# EasyEDA Pro project ProPrj_LPM012M134B_testboard_2025-07-12.epro

# Schematic Schematic1
Board Name: Board1; Create Date: 2025-06-02; Page Name: P1; Project Name: LPM012M134B_testboard; Schematic Name: Schematic1; Update Date: 2025-07-09; Company: 嘉立创EDA; Page Size: A4; Version: V1.0
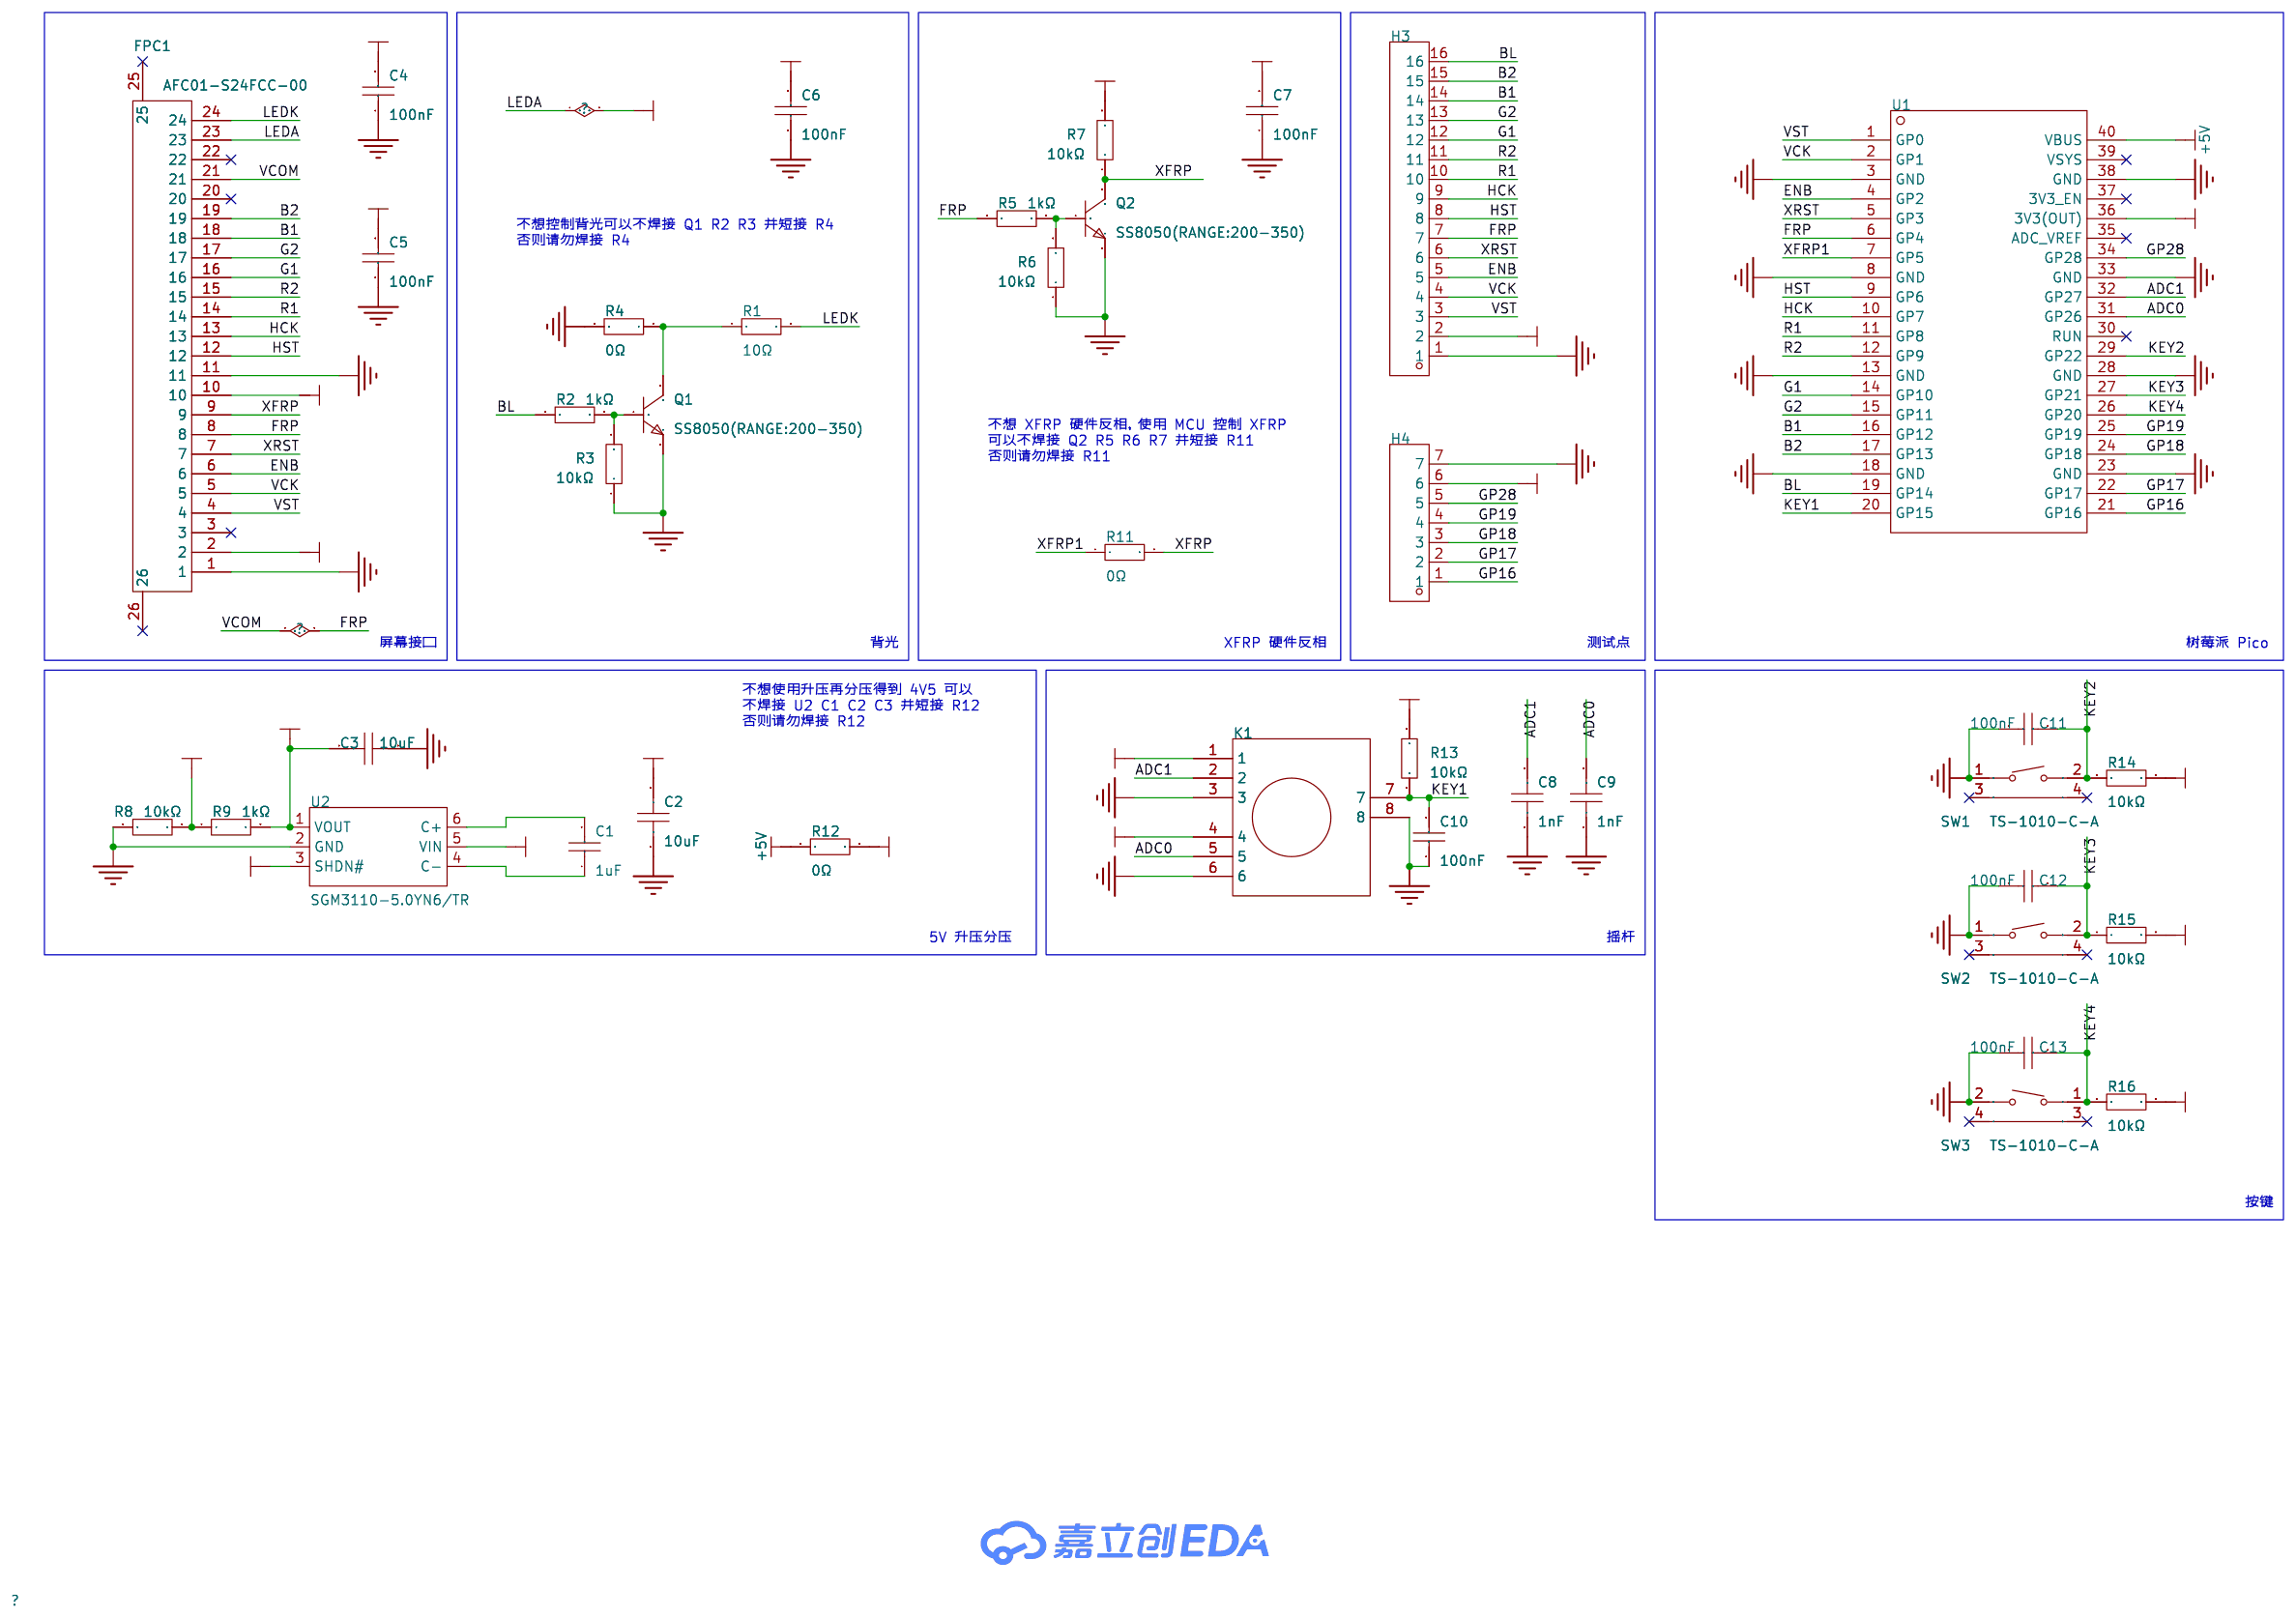
[diagram p0: schematic sheet]

## Parts
C1  1uF  [C0805]
C2  10uF  [C0805]
C3  10uF  [C0805]
C4  100nF  [C0805]
C5  100nF  [C0805]
C6  100nF  [C0805]
C7  100nF  [C0805]
C8  1nF  [C0805]
C9  1nF  [C0805]
C10  100nF  [C0805]
C11  100nF  [C0805]
C12  100nF  [C0805]
C13  100nF  [C0805]
FPC1  AFC01-S24FCC-00  [FPC-SMD_P0.5-24P_FGS-XJ-H2.0]
H3  -  [HDR-TH_16P-P2.54-V-M]
H4  -  [HDR-TH_7P-P2.54-V-M]
K1  -  [FJ08K-S]
Q1  SS8050(RANGE:200-350)  [SOT-23-3_L2.9-W1.3-P1.90-LS2.4-BR]
Q2  SS8050(RANGE:200-350)  [SOT-23-3_L2.9-W1.3-P1.90-LS2.4-BR]
R1  10Ω  [R0805_NEW]
R2  1kΩ  [R0805]
R3  10kΩ  [R0805]
R4  0Ω  [R0805]
R5  1kΩ  [R0805]
R6  10kΩ  [R0805]
R7  10kΩ  [R0805]
R8  10kΩ  [R0805]
R9  1kΩ  [R0805]
R11  0Ω  [R0805]
R12  0Ω  [R0805]
R13  10kΩ  [R0805]
R14  10kΩ  [R0805]
R15  10kΩ  [R0805]
R16  10kΩ  [R0805]
SW1  TS-1010-C-A  [KEY-SMD_TX-1010-X-X]
SW2  TS-1010-C-A  [KEY-SMD_TX-1010-X-X]
SW3  TS-1010-C-A  [KEY-SMD_TX-1010-X-X]
U1  -  [树莓派pico]
U2  SGM3110-5.0YN6/TR  [SOT-23-6_L2.9-W1.6-P0.95-LS2.8-BL]

## Library data of the parts
C1 = CL21B105KBFNNNE: 容值:1uF;精度:±10%;额定电压:50V;材质(温度系数):X7R;; LCSC Part Name: 1uF ±10% 50V; Supplier Part: C28323; Manufacturer: SAMSUNG(三星); Supplier Footprint: 0805; JLCPCB Part Class: 基础库; Datasheet: https://atta.szlcsc.com/upload/public/pdf/source/20160218/1457707763339.pdf; Supplier: LCSC; Tolerance: ±10%; Voltage Rated: 50V; Temperature Coefficient: X7R
C2 C3 = CL21A106KAYNNNE_C15850: 容值:10uF;精度:±10%;额定电压:25V;材质(温度系数):X5R;; LCSC Part Name: 10uF ±10% 25V; Supplier Part: C15850; Manufacturer: SAMSUNG(三星); Manufacturer Part: CL21A106KAYNNNE; Supplier Footprint: 0805; JLCPCB Part Class: 基础库; Datasheet: https://atta.szlcsc.com/upload/public/pdf/source/20160218/1457707763339.pdf; Supplier: LCSC; Tolerance: ±10%; Voltage Rated: 25V; Temperature Coefficient: X5R
C4-C7 C10-C13 = CL21B104KCFNNNE: 容值:100nF;精度:±10%;额定电压:100V;材质(温度系数):X7R;; LCSC Part Name: 100nF ±10% 100V; Supplier Part: C28233; Manufacturer: SAMSUNG(三星); Supplier Footprint: 0805; JLCPCB Part Class: 基础库; Datasheet: https://atta.szlcsc.com/upload/public/pdf/source/20160218/1457707763339.pdf; Supplier: LCSC; Tolerance: ±10%; Voltage Rated: 100V; Temperature Coefficient: X7R
C8 C9 = CC0805KRX7R9BB102: 容值:1nF;精度:±10%;额定电压:50V;材质(温度系数):X7R;; LCSC Part Name: 1nF ±10% 50V; Supplier Part: C94121; Manufacturer: YAGEO(国巨); Supplier Footprint: 0805; JLCPCB Part Class: 扩展库; Datasheet: https://atta.szlcsc.com/upload/public/pdf/source/20170211/1486785656773.pdf; Supplier: LCSC; Tolerance: ±10%; Voltage Rated: 50V; Temperature Coefficient: X7R
FPC1 = AFC01-S24FCC-00: 锁定特性:翻盖式;触点类型:下接;触点数量:24P;间距:0.5mm;安装类型:卧贴;; LCSC Part Name: 间距:0.5mm P数:24P 翻盖式 下接; Supplier Part: C262276; Manufacturer: JS(钜硕电子); Supplier Footprint: SMD,P=0.5mm,卧贴; JLCPCB Part Class: 扩展库; Datasheet: https://atta.szlcsc.com/upload/public/pdf/source/20190816/C413942_2A72D1AC756EAE17EEDF756A339D4500.pdf; Supplier: LCSC; Locking Feature: 翻盖式; Contact Type: 下接; Number of Contacts: 24P; Pitch: 0.5mm; Mounting Type: 卧贴; FFC, FCB Thickness: 0.3mm; Height Above Board: 2mm
H3 = HDR-M_2.54_1x16P: 间距:2.54mm;总PIN位数:16;排数:1;插针结构:1x16P;行距:-;安装类型:直插;圆针/方针:方针;额定电流:3A;额定电压:-;配合针长度:6mm;塑高:2.5mm;端接针长度:3mm;触头材质:-;工作温度范围:-40℃~+105℃;颜色:黑色;; Supplier Part: C2894939; Supplier Footprint: 插件
H4 = HDR-M_2.54_1x7P: Supplier Part: C492406; Supplier Footprint: 插件
K1 = FJ08K: 摇杆电位器+1开关
Q1 Q2 = SS8050(RANGE:200-350)_C2150: 晶体管类型:NPN;集电极电流(Ic):1.5A;集射极击穿电压(Vceo):25V;功率(Pd):300mW;直流电流增益(hFE@Ic,Vce):200@800mA,1V;; LCSC Part Name: NPN 电流:1.5A 耐压:25V hfe=200~350; Supplier Part: C2150; Manufacturer: CJ(江苏长电/长晶); Supplier Footprint: SOT-23; JLCPCB Part Class: 基础库; Datasheet: https://atta.szlcsc.com/upload/public/pdf/source/20230322/AEE86F4B043774EFF80CAEA14A37D9E9.pdf; Supplier: LCSC; Transistor Type: NPN; Collector Current (Ic): 1.5A; Collector-Emitter Breakdown Voltage (Vceo): 25V; Power Dissipation (Pd): 300mW; DC Current Gain (hFE@Ic,Vce): 200@800mA,1V; Transition Frequency (fT): 100MHz; Collector Cut-Off Current (Icbo): 100nA; Collector-Emitter Saturation Voltage (VCE(sat)@Ic,Ib): 500mV@800mA,80mA; Operating Temperature: -55℃~+150℃
R1 = 0805W8F100JT5E: 电阻类型:厚膜电阻;阻值:10Ω;精度:±1%;功率:125mW;最大工作电压:150V;温度系数:±200ppm/℃;; LCSC Part Name: 10Ω ±1% 125mW 厚膜电阻; Supplier Part: C17415; Manufacturer: UNI-ROYAL(厚声); Supplier Footprint: 0805; JLCPCB Part Class: 基础库; Datasheet: https://atta.szlcsc.com/upload/public/pdf/source/20200306/C422600_1E6D84923E4A46A82E41ADD87F860B5C.pdf; Supplier: LCSC; Type: 厚膜电阻; Tolerance: ±1%; Power(Watts): 125mW; Overload Voltage (Max): 150V; Temperature Coefficient: ±200ppm/℃; Operating Temperature Range: -55℃~+155℃
R2 R5 R9 = 0805W8F1001T5E: 电阻类型:厚膜电阻;阻值:1kΩ;精度:±1%;功率:125mW;最大工作电压:150V;温度系数:±100ppm/℃;; LCSC Part Name: 1kΩ ±1% 125mW 厚膜电阻; Supplier Part: C17513; Manufacturer: UNI-ROYAL(厚声); Supplier Footprint: 0805; JLCPCB Part Class: 基础库; Datasheet: https://atta.szlcsc.com/upload/public/pdf/source/20200306/C422600_1E6D84923E4A46A82E41ADD87F860B5C.pdf; Supplier: LCSC; Type: 厚膜电阻; Tolerance: ±1%; Power(Watts): 125mW; Overload Voltage (Max): 150V; Temperature Coefficient: ±100ppm/℃; Operating Temperature Range: -55℃~+155℃
R3 R6-R8 R13-R16 = 0805W8F1002T5E_C17414: 电阻类型:厚膜电阻;阻值:10kΩ;精度:±1%;功率:125mW;最大工作电压:150V;温度系数:±100ppm/℃;; LCSC Part Name: 10kΩ ±1% 125mW 厚膜电阻; Supplier Part: C17414; Manufacturer: UNI-ROYAL(厚声); Manufacturer Part: 0805W8F1002T5E; Supplier Footprint: 0805; JLCPCB Part Class: 基础库; Datasheet: https://atta.szlcsc.com/upload/public/pdf/source/20200306/C422600_1E6D84923E4A46A82E41ADD87F860B5C.pdf; Supplier: LCSC; Type: 厚膜电阻; Tolerance: ±1%; Power(Watts): 125mW; Overload Voltage (Max): 150V; Temperature Coefficient: ±100ppm/℃; Operating Temperature Range: -55℃~+155℃
R4 R11 R12 = 0805W8F0000T5E: 电阻类型:厚膜电阻;阻值:0Ω;精度:±1%;功率:125mW;最大工作电压:150V;温度系数:±800ppm/℃;; LCSC Part Name: 0Ω ±1% 125mW 厚膜电阻; Supplier Part: C17477; Manufacturer: UNI-ROYAL(厚声); Supplier Footprint: 0805; JLCPCB Part Class: 基础库; Datasheet: https://atta.szlcsc.com/upload/public/pdf/source/20200306/C422600_1E6D84923E4A46A82E41ADD87F860B5C.pdf; Supplier: LCSC; Type: 厚膜电阻; Tolerance: ±1%; Power(Watts): 125mW; Overload Voltage (Max): 150V; Temperature Coefficient: ±800ppm/℃; Operating Temperature Range: -55℃~+155℃
SW1-SW3 = TS-1010-C-A: 电路结构:单刀单掷;按钮形状:矩形按钮;作用力:260gf;安装方式:卧贴;开关长度:2.3mm;开关宽度:4.7mm;开关高度:3.5mm;带支架:不带;触点电流:50mA;额定电压(AC):-;额定电压(DC):12V;额定功率:-;绝缘电阻:-;带灯:无;机械寿命:10万次;; LCSC Part Name: 2.3*4.7*3.5mm 卧贴 轻触开关; Supplier Part: C692458; Manufacturer: XKB Connectivity(中国星坤); Supplier Footprint: SMD; JLCPCB Part Class: 扩展库; Datasheet: https://atta.szlcsc.com/upload/public/pdf/source/20211011/09621D275CE0F472C941775DFBBCCC96.pdf; Supplier: LCSC; Circuit: 单刀单掷; Actuator Style: 矩形按钮; Operating Force: 260gf; Mounting Style: 卧贴; Switch Length: 2.3mm; Switch Width: 4.7mm; Switch Height: 3.5mm; Strike Gundam: 不带; Contact Current: 50mA; Voltage Rating (DC): 12V; Actuator/Cap Color: 黑色; With Lamp: 无; Mechanical Life: 10万次; Operating Temperature: -30℃~+85℃
U1 = 树莓派pico
U2 = SGM3110-5.0YN6/TR: Supplier Part: C148124; Manufacturer: SGMICRO(圣邦微); Supplier Footprint: SOT-23-6; JLCPCB Part Class: 扩展库; Datasheet: https://atta.szlcsc.com/upload/public/pdf/source/20190614/C148124_1D2DD7C29EA574535439DC9524E85CD8.pdf; Supplier: LCSC

## Nets
3V3: C2.2 C4.2 C6.2 C7.2 FPC1.10 FPC1.23 H3.2 H4.6 K1.1 K1.4 R7.2 R13.2 R14.2 R15.2 R16.2 U1.36(3V3(OUT)) U2.3(SHDN#) U2.5(VIN)
4V5: C5.2 FPC1.2 R8.1 R9.1
+5V: R12.1 U1.40(VBUS)
GND: C2.1 C3.2 C4.1 C5.1 C6.1 C7.1 C8.1 C9.1 C10.1 C11.1 C12.1 C13.1 FPC1.1 FPC1.11 H3.1 H4.7 K1.3 K1.6 K1.8 Q1.2(E) Q2.2(E) R3.1 R4.2 R6.1 R8.2 SW1.1 SW2.1 SW3.2 U1.3(GND) U1.8(GND) U1.13(GND) U1.18(GND) U1.23(GND) U1.28(GND) U1.33(GND) U1.38(GND) U2.2(GND)
ADC0: C9.2 K1.5 U1.31(GP26)
ADC1: C8.2 K1.2 U1.32(GP27)
B1: FPC1.18 H3.14 U1.16(GP12)
B2: FPC1.19 H3.15 U1.17(GP13)
BL: H3.16 R2.1 U1.19(GP14)
ENB: FPC1.6 H3.5 U1.4(GP2)
FRP: FPC1.8 FPC1.21 H3.7 R5.1 U1.6(GP4)
G1: FPC1.16 H3.12 U1.14(GP10)
G2: FPC1.17 H3.13 U1.15(GP11)
GP16: H4.1 U1.21(GP16)
GP17: H4.2 U1.22(GP17)
GP18: H4.3 U1.24(GP18)
GP19: H4.4 U1.25(GP19)
GP28: H4.5 U1.34(GP28)
HCK: FPC1.13 H3.9 U1.10(GP7)
HST: FPC1.12 H3.8 U1.9(GP6)
KEY1: C10.2 K1.7 R13.1 U1.20(GP15)
KEY2: C11.2 R14.1 SW1.2 U1.29(GP22)
KEY3: C12.2 R15.1 SW2.2 U1.27(GP21)
KEY4: C13.2 R16.1 SW3.1 U1.26(GP20)
LEDK: FPC1.24 R1.2
R1: FPC1.14 H3.10 U1.11(GP8)
R2: FPC1.15 H3.11 U1.12(GP9)
SGM_VOUT: C3.1 R9.2 R12.2 U2.1(VOUT)
VCK: FPC1.5 H3.4 U1.2(GP1)
VST: FPC1.4 H3.3 U1.1(GP0)
XFRP: FPC1.9 Q2.3(C) R7.1 R11.2
XFRP1: R11.1 U1.7(GP5)
XRST: FPC1.7 H3.6 U1.5(GP3)
$1N1291: Q1.3(C) R1.1 R4.1
$1N1365: Q1.1(B) R2.2 R3.2
$1N1713: Q2.1(B) R5.2 R6.2
$1N2010: C1.2 U2.6(C+)
$1N2014: C1.1 U2.4(C-)

Not connected (* = marked no-connect by the designer): FPC1 3* 20* 22* 25* 26*; SW1 3* 4*; SW2 3* 4*; SW3 3* 4*; U1 30(RUN)* 35(ADC_VREF)* 37(3V3_EN)* 39(VSYS)*

## Notes on the sheet
- 不想控制背光可以不焊接 Q1 R2 R3 并短接 R4
  否则请勿焊接 R4
- 不想 XFRP 硬件反相，使用 MCU 控制 XFRP
  可以不焊接 Q2 R5 R6 R7 并短接 R11
  否则请勿焊接 R11
- 屏幕接口
- 背光
- XFRP 硬件反相
- 测试点
- 树莓派 Pico
- 不想使用升压再分压得到 4V5 可以
  不焊接 U2 C1 C2 C3 并短接 R12
  否则请勿焊接 R12
- 5V 升压分压
- 摇杆
- 按键

# Board PCB1
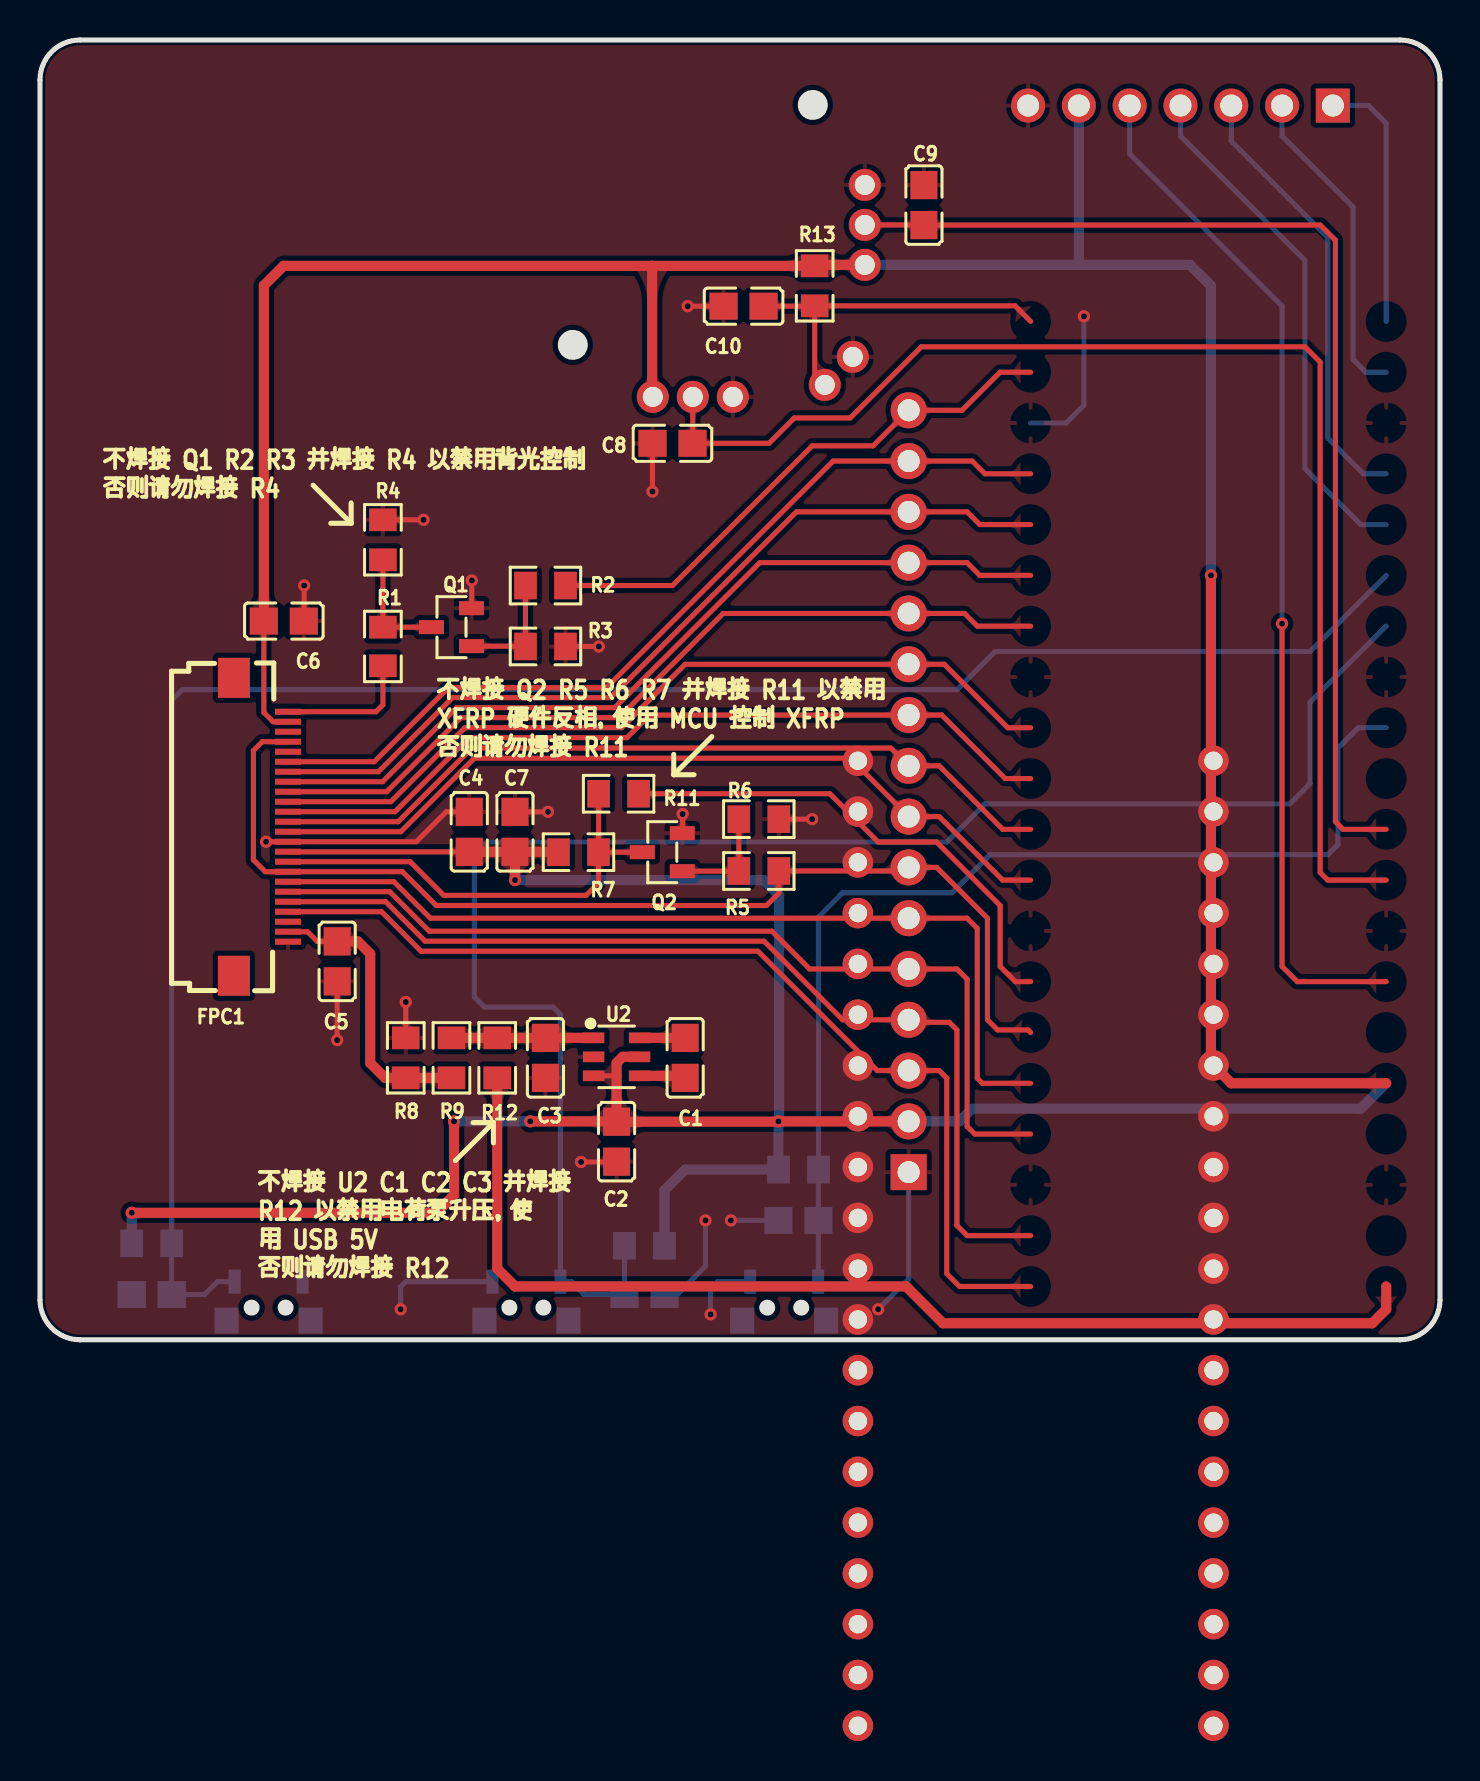
[diagram p1: board, top side]
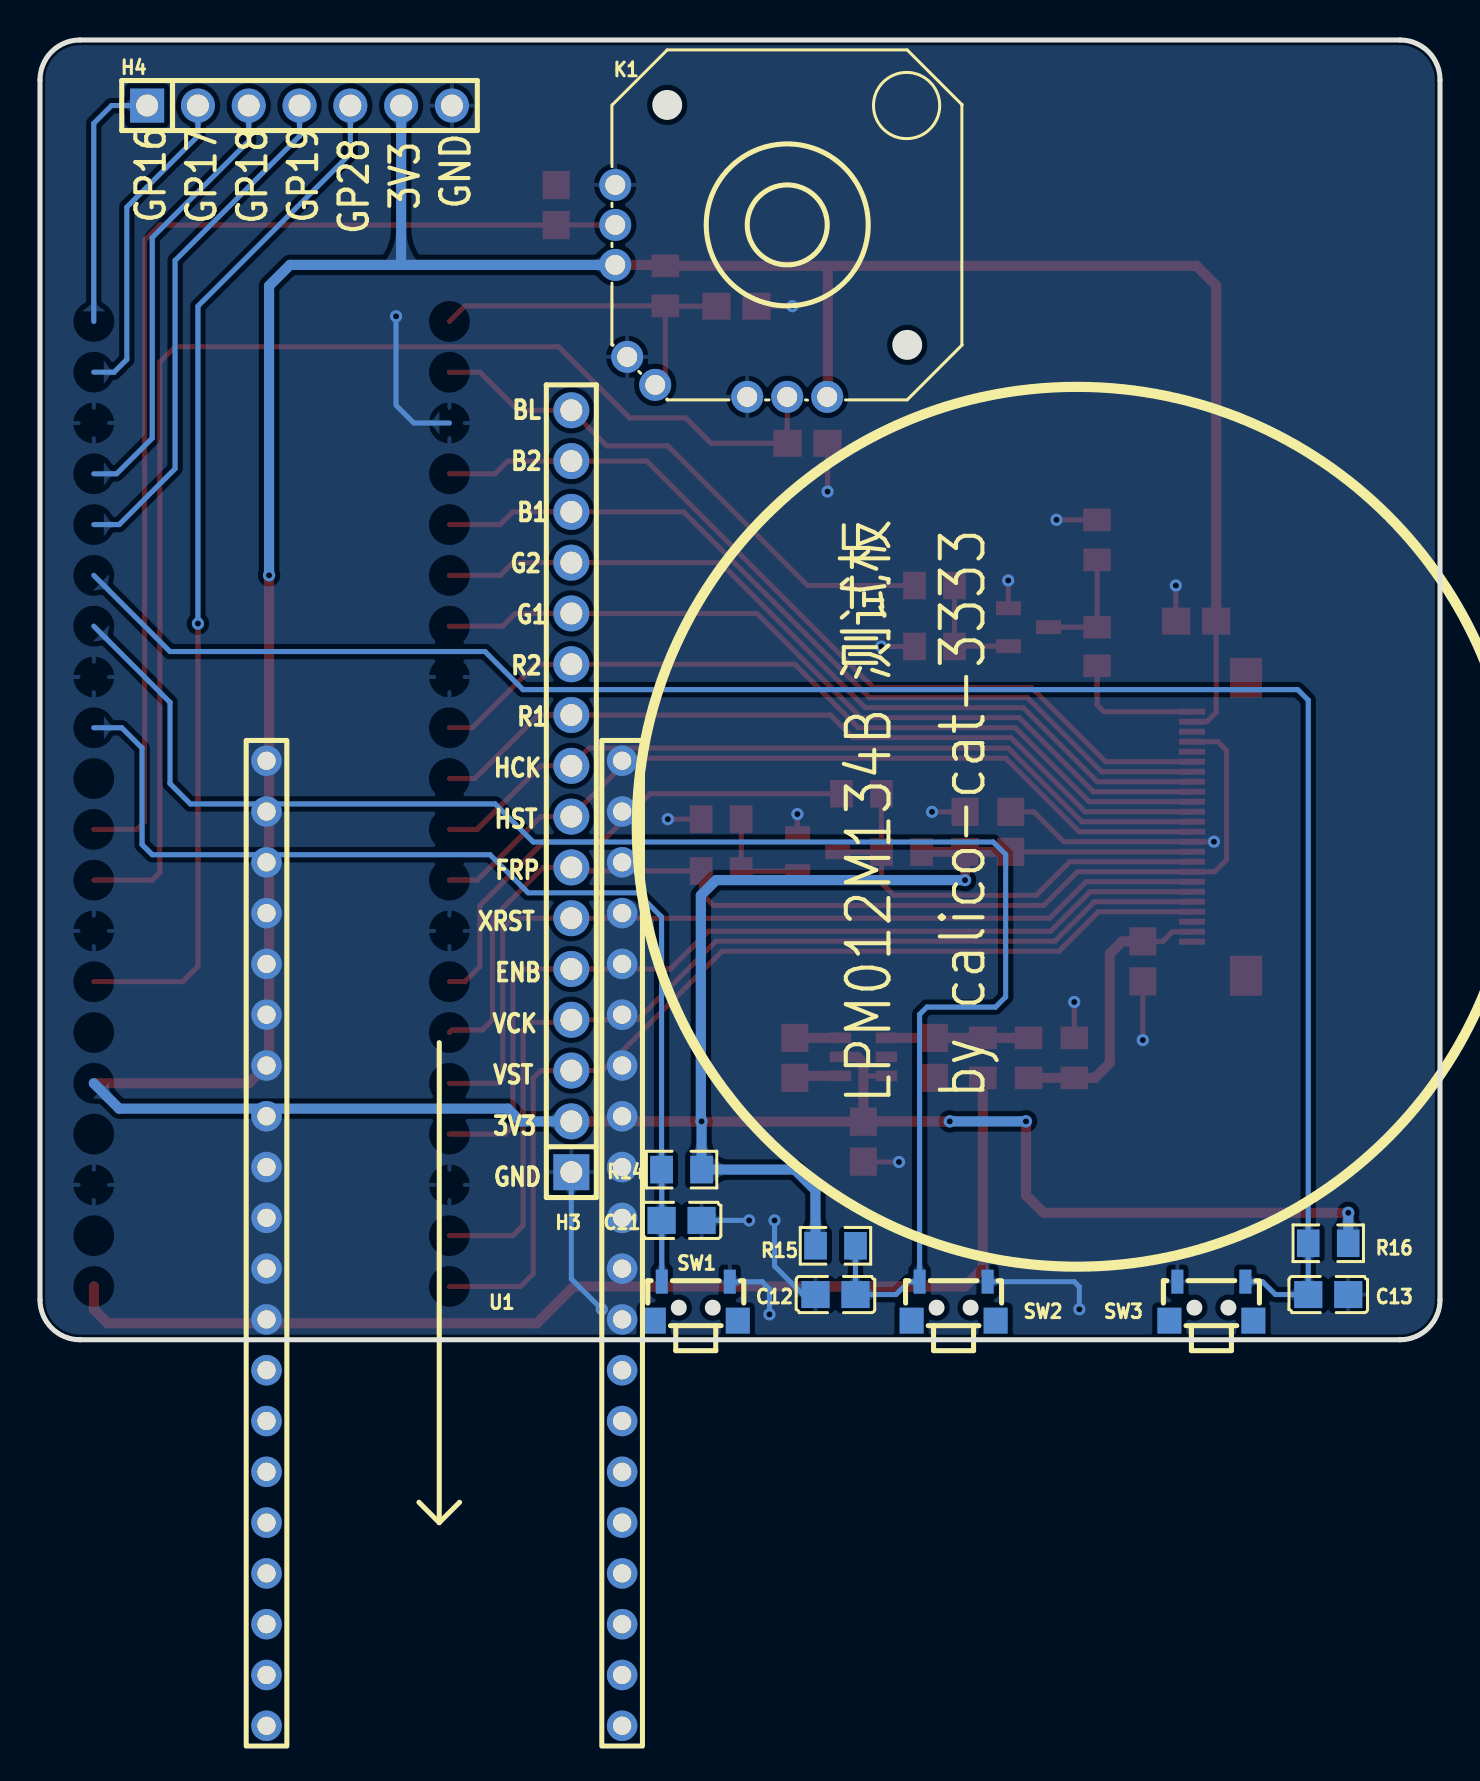
[diagram p2: board, bottom side, seen from below]

Outline 70 x 65 mm; copper layers: Top Layer, Bottom Layer. Coordinates in mm from the lower left corner of the outline.
Outline path: 0,63 0,2 arc(0.59,0.59) 2,0 68,0 arc(69.41,0.59) 70,2 70,63 arc(69.41,64.41) 68,65 2,65 arc(0.59,64.41) 0,63
Stack: Top Layer 0.035mm / Dielectric1 1.51mm FR4 er 4.5 / Bottom Layer 0.035mm

## Design rules (mm)
template: JLCPCB Capability(Two Layers Board)
spacing copperThickness1oz (default): track to track 0.102, other pairs 0.152 to 0.3
spacing copperThickness2oz: track to track 0.203, other pairs 0.152 to 0.3
track width copperThickness1oz (default): min 0.127, default 0.254, max 2.54
track width copperThickness2oz: min 0.203, default 0.254, max 2.54
differential pair differentialPair (default): width min 0.127, default 0.254, max 2.54; gap min 0.152, default 0.152
via viaSize (default): diameter min 0.5, default 0.61, max 10; hole min 0.3, default 0.305, max 6.3

## Placement (name value [footprint] x y rotation side)
C1  1uF  [C0805]  32.26 14.1 90 top
C2  10uF  [C0805]  28.83 9.91 90 top
C3  10uF  [C0805]  25.27 14.1 270 top
C4  100nF  [C0805]  21.46 25.4 270 top
C5  100nF  [C0805]  14.86 18.92 90 top
C6  100nF  [C0805]  12.19 35.94 180 top
C7  100nF  [C0805]  23.75 25.4 270 top
C8  1nF  [C0805]  31.62 44.83 0 top
C9  1nF  [C0805]  44.2 56.74 270 top
C10  100nF  [C0805]  35.18 51.69 0 top
C11  100nF  [C0805]  37.92 5.97 0 bottom
C12  100nF  [C0805]  30.23 2.26 180 bottom
C13  100nF  [C0805]  5.59 2.26 0 bottom
FPC1  AFC01-S24FCC-00  [FPC-SMD_P0.5-24P_FGS-XJ-H2.0]  11.05 25.65 90 top
H3  -  [HDR-TH_16P-P2.54-V-M]  43.43 27.43 90 bottom
H4  -  [HDR-TH_7P-P2.54-V-M]  57.02 61.72 180 bottom
K1  -  [FJ08K-S]  32.64 55.75 0 bottom
Q1  SS8050(RANGE:200-350)  [SOT-23-3_L2.9-W1.3-P1.90-LS2.4-BR]  20.57 35.64 0 top
Q2  SS8050(RANGE:200-350)  [SOT-23-3_L2.9-W1.3-P1.90-LS2.4-BR]  31.12 24.38 0 top
R1  10Ω  [R0805_NEW]  17.14 34.67 270 top
R2  1kΩ  [R0805]  25.27 37.72 180 top
R3  10kΩ  [R0805]  25.27 34.67 180 top
R4  0Ω  [R0805]  17.14 40 90 top
R5  1kΩ  [R0805]  35.94 23.44 180 top
R6  10kΩ  [R0805]  35.94 26.03 180 top
R7  10kΩ  [R0805]  26.92 24.38 180 top
R8  10kΩ  [R0805]  18.29 14.1 90 top
R9  1kΩ  [R0805]  20.57 14.1 90 top
R11  0Ω  [R0805]  28.93 27.31 180 top
R12  0Ω  [R0805]  22.86 14.1 90 top
R13  10kΩ  [R0805]  38.74 52.7 90 top
R14  10kΩ  [R0805]  37.92 8.51 180 bottom
R15  10kΩ  [R0805]  30.23 4.7 0 bottom
R16  10kΩ  [R0805]  5.59 4.83 180 bottom
SW1  TS-1010-C-A  [KEY-SMD_TX-1010-X-X]  37.21 1.93 0 bottom
SW2  TS-1010-C-A  [KEY-SMD_TX-1010-X-X]  24.32 1.93 0 bottom
SW3  TS-1010-C-A  [KEY-SMD_TX-1010-X-X]  11.43 1.93 0 bottom
U1  -  [树莓派pico]  58.42 26.8 90 bottom
U2  SGM3110-5.0YN6/TR  [SOT-23-6_L2.9-W1.6-P0.95-LS2.8-BL]  28.83 14.15 270 top

## Footprints (pads in the part's own frame, mm; a bottom-side part is the same pattern mirrored in y, then rotated)
C0805
  rect 1.41x1.35 smd: 1(-1,0) 2(1,0)
FJ08K-S
  round 1.6 hole 1: 1(-2,8.6) 2(0,8.6) 3(2,8.6) 4(8.6,2) 5(8.6,0) 6(8.6,-2) 7(6.6,8) 8(8,6.6)
FPC-SMD_P0.5-24P_FGS-XJ-H2.0
  rect 0.3x1.3 smd: 1(-5.748,-1.351) 2(-5.248,-1.351) 3(-4.748,-1.351) 4(-4.248,-1.351) 5(-3.748,-1.351) 6(-3.248,-1.351) 7(-2.748,-1.351) 8(-2.248,-1.351) 9(-1.748,-1.351) 10(-1.248,-1.351) 11(-0.748,-1.351) 12(-0.248,-1.351) 13(0.252,-1.351) 14(0.752,-1.351) 15(1.252,-1.351) 16(1.752,-1.351) 17(2.252,-1.351) 18(2.752,-1.351) 19(3.252,-1.351) 20(3.752,-1.351) 21(4.252,-1.351) 22(4.752,-1.351) 23(5.252,-1.351) 24(5.752,-1.351)
  rect 2x1.6 smd: 25(7.45,1.351) 26(-7.45,1.351)
HDR-TH_7P-P2.54-V-M
  rect 1.7x1.7 hole 1.1: 1(-7.62,0)
  round 1.7 hole 1.1: 2(-5.08,0) 3(-2.54,0) 4(0,0) 5(2.54,0) 6(5.08,0) 7(7.62,0)
HDR-TH_16P-P2.54-V-M
  rect 1.8x1.8 hole 1.1: 1(-19.05,0)
  round 1.8 hole 1.1: 2(-16.51,0) 3(-13.97,0) 4(-11.43,0) 5(-8.89,0) 6(-6.35,0) 7(-3.81,0) 8(-1.27,0) 9(1.27,0) 10(3.81,0) 11(6.35,0) 12(8.89,0) 13(11.43,0) 14(13.97,0) 15(16.51,0) 16(19.05,0)
KEY-SMD_TX-1010-X-X
  rect 0.6x1.2 smd: 1(-1.7,-0.975) 2(1.7,-0.975)
  rect 1.2x1.3 smd: 3(-2.1,0.975) 4(2.1,0.975)
R0805
  rect 1.133x1.377 smd: 1(-1,0) 2(1,0)
R0805_NEW
  rect 1.133x1.377 smd: 1(-0.966,0) 2(0.966,0)
SOT-23-3_L2.9-W1.3-P1.90-LS2.4-BR
  rect 1.25x0.7 smd: 1(1,-0.95) 2(1,0.95) 3(-1,0)
SOT-23-6_L2.9-W1.6-P0.95-LS2.8-BL
  rect 0.532x1.072 smd: 1(-0.95,-1.149) 2(0,-1.149) 3(0.95,-1.149) 4(0.95,1.149) 5(0,1.149) 6(-0.95,1.149)
树莓派pico
  round 1.524 hole 0.914: 1(-46.101,-17.526) 2(-43.561,-17.526) 3(-41.021,-17.526) 4(-38.481,-17.526) 5(-35.941,-17.526) 6(-33.401,-17.526) 7(-30.861,-17.526) 8(-28.321,-17.526) 9(-25.781,-17.526) 10(-23.241,-17.526) 11(-20.701,-17.526) 12(-18.161,-17.526) 13(-15.621,-17.526) 14(-13.081,-17.526) 15(-10.541,-17.526) 16(-8.001,-17.526) 17(-5.461,-17.526) 18(-2.921,-17.526) 19(-0.381,-17.526) 20(2.159,-17.526) 21(2.159,0.254) 22(-0.381,0.254) 23(-2.921,0.254) 24(-5.461,0.254) 25(-8.001,0.254) 26(-10.541,0.254) 27(-13.081,0.254) 28(-15.621,0.254) 29(-18.161,0.254) 30(-20.701,0.254) 31(-23.241,0.254) 32(-25.781,0.254) 33(-28.321,0.254) 34(-30.861,0.254) 35(-33.401,0.254) 36(-35.941,0.254) 37(-38.481,0.254) 38(-41.021,0.254) 39(-43.561,0.254) 40(-46.101,0.254)

## Nets
As in the schematic.

Pads without a net: FPC1 3 20 22 25 26; SW1 3 4; SW2 3 4; SW3 3 4; U1 30 35 37 39

## Via types
v1: diameter 0.61, hole 0.305, Top Layer to Bottom Layer, 26 vias

## Routing (per net, layer and track width the routed paths; a pad name or vN(x,y) marks a point on that pad's centre or on a via; arc(x,y) is an arc through that point)
3V3: length 259.1
  Top Layer w0.254: FPC1.10 12.41,24.4 C4.2 ; FPC1.23 11.66,30.91 11.19,31.37 C6.2 ; 28.83,13.2 28.82,13.2 U2.3
  Top Layer w0.508: C2.2 28.81,10.92 v1(24.51,10.92) ; C2.2 28.83,13.84 29.13,14.15 U2.5 ; C2.2 36.91,10.91 v1(36.92,10.92) H3.2 ; C4.2 C7.2 ; C7.2 v1(23.75,22.99) ; C7.2 25.91,24.4 R7.2 ; v1(20.7,10.92) 20.7,7.24 19.81,6.35 v1(4.59,6.35) ; K1.1 30.61,47.19 30.61,53.7 ; C6.2 11.19,52.72 12.18,53.7 30.61,53.7 ; 30.61,53.7 R13.2 38.78,53.75 K1.4 ; v1(58.55,38.23) 58.55,13.84 59.56,12.83 67.31,12.83
  Bottom Layer w0.508: v1(20.7,10.92) v1(24.51,10.92) ; v1(23.75,22.99) 36.19,22.99 36.96,22.22 36.96,10.96 v1(36.92,10.92) R14.2 32.26,8.51 31.23,7.48 R15.2 ; 51.96,53.75 57.5,53.75 58.55,52.7 v1(58.55,38.23) ; 51.96,53.75 K1.4 ; 51.96,53.75 51.94,53.77 51.94,61.72 ; R16.2 v1(4.59,6.35) ; H3.2 45.97,10.92 46.61,11.56 66.04,11.56 67.31,12.83
4V5: length 14.4
  Top Layer w0.254: FPC1.2 13.38,20.41 13.86,19.92 C5.2
  Top Layer w0.508: R9.1 R8.1 17.26,13.1 16.51,13.84 16.51,19.3 15.89,19.92 C5.2
+5V: length 56.6
  Top Layer w0.508: 67.31,2.67 67.31,1.52 66.61,0.83 45.15,0.83 43.31,2.67 23.75,2.67 22.86,3.56 R12.1
GND: length 64.2
  Top Layer w0.254: C8.1 v1(30.62,42.42) ; R6.1 v1(38.61,26.03) ; R4.2 v1(19.18,41) ; C4.1 20.3,26.4 18.81,24.91 FPC1.11 v1(11.3,24.91) ; R3.1 v1(27.94,34.67) ; v1(13.21,37.72) 13.21,35.96 C6.1 ; C7.1 v1(25.4,26.4) ; R8.2 v1(18.29,16.89) ; C2.1 28.81,8.89 v1(27.05,8.89) ; v1(32.13,26.29) 32.13,25.35 Q2.2 ; C5.1 v1(14.86,14.99) ; C10.1 v1(32.38,51.69) ; v1(21.59,37.97) 21.59,36.6 Q1.2
  Bottom Layer w0.254: C11.1 v1(34.54,5.97) ; v1(52.2,51.18) 52.2,46.74 51.31,45.85 49.53,45.85 ; H3.1 43.43,3.05 v1(41.91,1.52) ; SW1.1 33.89,2.91 33.53,2.54 v1(33.53,1.27) ; v1(18.03,1.52) 18.03,2.65 18.29,2.91 SW2.1 ; C12.1 31.85,2.26 33.27,3.68 v1(33.27,5.97)
ADC0: length 55.6
  Top Layer w0.254: 67.31,25.53 65.15,25.53 64.77,25.91 64.77,54.99 64.02,55.74 C9.2 44.19,55.75 K1.5
ADC1: length 65
  Top Layer w0.254: K1.2 32.64,44.85 C8.2 36.45,44.83 37.72,46.1 40.51,46.1 44.07,49.66 63.25,49.66 64.01,48.89 64.01,23.37 64.39,22.99 67.31,22.99
B1: length 42.8
  Top Layer w0.254: 49.53,40.77 46.99,40.77 46.35,41.4 H3.14 37.82,41.4 28.53,32.11 20.62,32.11 16.92,28.41 FPC1.18
B2: length 43.6
  Top Layer w0.254: 49.53,43.31 47.24,43.31 46.61,43.94 H3.15 39.65,43.94 28.32,32.61 20.42,32.61 16.71,28.91 FPC1.19
BL: length 27.7
  Top Layer w0.254: R2.1 31.62,37.72 38.61,44.7 41.66,44.7 H3.16 46.1,46.48 48.01,48.39 49.53,48.39
ENB: length 46.5
  Top Layer w0.254: 49.53,10.29 46.74,10.29 46.35,10.67 46.35,18.03 45.85,18.54 H3.5 38.48,18.54 36.59,20.43 19.46,20.43 17.49,22.41 FPC1.6
FRP: length 55
  Top Layer w0.254: FPC1.21 11.11,29.91 10.67,29.46 10.67,24 11.27,23.41 FPC1.8 18.12,23.41 19.81,21.72 36.32,21.72 36.94,22.34 R5.1 43.26,23.44 H3.7 44.83,23.62 47.37,21.08 47.37,16 47.88,15.49 49.4,15.49 49.53,15.37
G1: length 41.1
  Top Layer w0.254: 49.53,35.69 46.86,35.69 46.23,36.32 H3.12 34.16,36.32 28.94,31.11 21.04,31.11 17.33,27.41 FPC1.16
G2: length 41.9
  Top Layer w0.254: 49.53,38.23 46.99,38.23 46.35,38.86 H3.13 35.99,38.86 28.74,31.61 20.83,31.61 17.13,27.91 FPC1.17
GP16: length 12.9
  Bottom Layer w0.254: H4.1 66.42,61.72 67.31,60.83 67.31,50.93
GP17: length 16.1
  Bottom Layer w0.254: H4.2 62.1,60.2 65.66,56.64 65.66,49.02 66.29,48.39 67.31,48.39
GP18: length 22.3
  Bottom Layer w0.254: 67.31,43.31 66.17,43.31 64.39,45.08 64.39,55.12 59.56,59.94 H4.3
GP19: length 26
  Bottom Layer w0.254: H4.4 57.02,60.2 63.25,53.97 63.25,43.56 66.04,40.77 67.31,40.77
GP28: length 51.7
  Top Layer w0.254: v1(62.1,35.81) 62.1,18.67 62.87,17.91 67.31,17.91
  Bottom Layer w0.254: v1(62.1,35.81) 62.1,51.69 54.48,59.31 H4.5
HCK: length 40.3
  Top Layer w0.254: FPC1.13 17.91,25.91 21.59,29.59 42.54,29.59 H3.9 44.96,28.7 48.13,25.53 49.53,25.53
HST: length 41.2
  Top Layer w0.254: 49.53,22.99 48.13,22.99 44.96,26.16 H3.8 40.51,29.08 21.72,29.08 18.04,25.41 FPC1.12
KEY1: length 17.8
  Top Layer w0.254: C10.2 38.72,51.69 R13.1 ; 49.53,50.93 48.75,51.7 R13.1 ; R13.1 38.74,48.26 K1.7
KEY2: length 53.4
  Bottom Layer w0.254: 67.31,30.61 65.91,30.61 64.9,29.59 64.9,24.77 64.39,24.26 47.5,24.26 45.59,22.35 40.13,22.35 38.92,21.14 R14.1 38.91,8.5 SW1.2
KEY3: length 83.8
  Bottom Layer w0.254: R15.1 C12.2 27.2,2.26 26.56,2.91 SW2.2 26.02,16.27 25.65,16.64 22.22,16.64 21.72,17.14 21.72,24.27 22.34,24.89 45.34,24.89 47.24,26.8 62.48,26.8 63.5,27.81 63.5,31.88 67.31,35.69
KEY4: length 96.4
  Bottom Layer w0.254: 67.31,38.23 63.5,34.42 47.75,34.42 45.85,32.51 7.11,32.51 6.59,31.99 R16.1 C13.2 8.23,2.26 8.87,2.91 SW3.1
LEDK: length 6.8
  Top Layer w0.254: 17.14,33.7 17.14,31.75 16.8,31.41 FPC1.24
R1: length 40.4
  Top Layer w0.254: FPC1.14 17.75,26.41 21.45,30.11 29.35,30.11 30.48,31.24 H3.10 45.09,31.24 48.26,28.07 49.53,28.07
R2: length 41.3
  Top Layer w0.254: 49.53,30.61 48.39,30.61 45.21,33.78 H3.11 32.26,33.78 29.09,30.61 21.25,30.61 17.54,26.91 FPC1.15
SGM_VOUT: length 7.1
  Top Layer w0.508: R9.2 R12.2 C3.1 27.68,15.1
VCK: length 49.8
  Top Layer w0.254: 49.53,5.21 46.35,5.21 45.85,5.72 45.85,15.49 45.47,15.88 43.56,15.88 H3.4 40.13,16 36.2,19.93 19.26,19.93 17.28,21.91 FPC1.5
VST: length 50.6
  Top Layer w0.254: 49.53,2.67 45.97,2.67 45.34,3.3 45.34,13.08 44.96,13.46 H3.3 41.87,13.46 35.9,19.43 19.05,19.43 17.08,21.41 FPC1.4
XFRP: length 23.1
  Top Layer w0.254: FPC1.9 18.51,23.91 20.19,22.22 27.31,22.22 27.92,22.84 R7.1 ; R7.1 27.93,24.39 R11.2 ; R7.1 Q2.3
XFRP1: length 25.3
  Top Layer w0.254: 49.53,17.91 48.77,17.91 48.01,18.67 48.01,21.72 44.83,24.89 41.91,24.89 39.5,27.31 R11.1
XRST: length 45.7
  Top Layer w0.254: 49.53,12.83 47.12,12.83 46.86,13.08 46.86,20.57 46.35,21.08 H3.6 19.52,21.08 17.7,22.91 FPC1.7
$1N1291: length 5.8
  Top Layer w0.254: Q1.3 17.15,35.64 ; R4.1 R1.1
$1N1365: length 5.8
  Top Layer w0.254: R2.2 R3.2 24.26,34.69 Q1.1
$1N1713: length 5.4
  Top Layer w0.254: Q2.1 34.93,23.43 R5.2 R6.2
$1N2010: length 2.3
  Top Layer w0.508: 29.98,15.1 C1.2
$1N2014: length 2.3
  Top Layer w0.508: C1.1 32.16,13.2 U2.4

## Copper pours and planes (outline as drawn; the poured copper is in the pictures)
GND on Top Layer: -8.51,74.3 75.69,74.3 75.69,-8 -8.51,-8
GND on Bottom Layer: -4.57,70.23 72.64,70.23 72.64,-4.57 -4.57,-4.57

Small or netless copper shapes (teardrops, artwork), in the pictures only: 158 on Top Layer, 56 on Bottom Layer

## Text on the board
Bottom Silkscreen Layer: B1 | R1 | G1 | BL | B2 | R2 | G2 | FRP | ENB | HST | HCK | VST | 3V3 | VCK | XRST | GND | GP28 | GP19 | GP18 | GP17 | GP16 | by calico-cat-3333 | LPM012M134B 测试板
Top Silkscreen Layer: 不焊接 U2 C1 C2 C3 并焊接 / R12 以禁用电荷泵升压，使 / 用 USB 5V / 否则请勿焊接 R12 | 不焊接 Q2 R5 R6 R7 并焊接 R11 以禁用 / XFRP 硬件反相，使用 MCU 控制 XFRP / 否则请勿焊接 R11 | 不焊接 Q1 R2 R3 并焊接 R4 以禁用背光控制 / 否则请勿焊接 R4
